# EasyEDA schematic SCH_miniEsp_2025-01-17.json
TITLE: miniEsp; REV: 1.0; Date: 2024-12-11; Sheet: 1/1; Drawn By: Valerian Tora; Company: unemployed
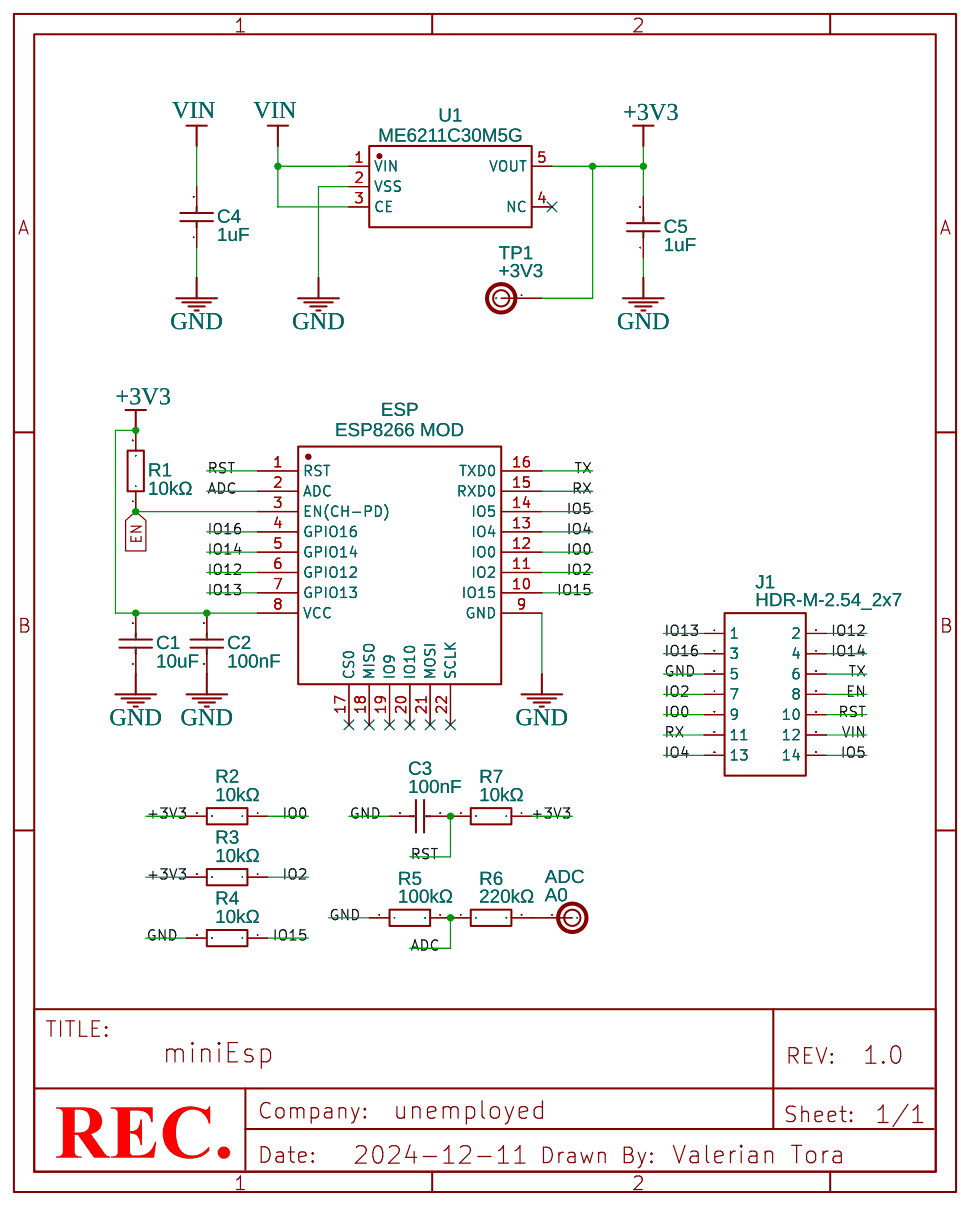
[diagram p0: schematic sheet]

## Parts
ADC  A0  [TESTPOINT_0.8MM]
C1  10uF  [C0805]
C2  100nF  [C0805]
C3  100nF  [C0805]
C4  1uF  [C0805]
C5  1uF  [C0805]
ESP  ESP8266 MOD  [ESP-12E(ESP8266MOD)]
J1  HDR-M-2.54_2x7  [HDR-M-2.54_2X7]
R1  10kΩ  [R0603]
R2  10kΩ  [R0603]
R3  10kΩ  [R0603]
R4  10kΩ  [R0603]
R5  100kΩ  [R0603]
R6  220kΩ  [R0603]
R7  10kΩ  [R0603]
TP1  +3V3  [TESTPOINT_0.8MM]
U1  ME6211C30M5G  [SOT-23-5_L3.0-W1.7-P0.95-LS2.8-BR]

## Library data of the parts
ADC TP1 = Test Point: Contributor: Valerian Tora
C1 = CL21A106KPFNNNE: Supplier: LCSC; Manufacturer: SAMSUNG(三星); Supplier Part: C17024; JLCPCB Part Class: Extended Part; link: https://lcsc.com/eda_search?q=C17024&%26type=1&ref=editor
C2 C3 = CL21B104KBCNNNC: Supplier: LCSC; Manufacturer: SAMSUNG(三星); Supplier Part: C1711; JLCPCB Part Class: Extended Part
C4 C5 = CL21B105KBFNNNE: Supplier: LCSC; Manufacturer: SAMSUNG(三星); Supplier Part: C28323; JLCPCB Part Class: Basic Part
ESP = ESP8266 12F: Manufacturer: Ai-Thinker(安信可); Manufacturer Part: ESP-12F(ESP8266MOD); JLCPCB Part Class: Extended Part
J1 = HDR-M-2.54_2x7: Supplier Part: C71397; Supplier: LCSC; Contributor: LCEDA_Lib
R1-R4 R7 = AC0603FR-0710KL: Supplier: LCSC; Manufacturer: YAGEO(国巨); Supplier Part: C116677; JLCPCB Part Class: Extended Part
R5 = RC0603FR-07100KL: Contributor: LCSC; Supplier: LCSC; Supplier Part: C14675; Manufacturer: YAGEO(国巨); JLCPCB Part Class: Extended Part
R6 = RC0603FR-07220KL: Supplier: LCSC; Manufacturer: YAGEO(国巨); Supplier Part: C123420; JLCPCB Part Class: Extended Part
U1 = ME6211C30M5G: Contributor: LCSC; Supplier: LCSC; Supplier Part: C94042; Manufacturer: MICRONE(南京微盟); JLCPCB Part Class: Extended Part

## Nets
+3V3: C1.2 C2.2 C5.2 ESP.8(VCC) R1.2 R2.2 R3.2 R7.1 TP1.1 U1.5(VOUT)
GND: C1.1 C2.1 C3.2 C4.1 C5.1 ESP.9(GND) J1.5 R4.2 R5.1 U1.2(VSS)
VIN: C4.2 J1.12 U1.1(VIN) U1.3(CE)
ADC: ESP.2(ADC) R5.2 R6.1
EN: ESP.3(EN(CH-PD)) J1.8 R1.1
IO0: ESP.12(IO0) J1.9 R2.1
IO2: ESP.11(IO2) J1.7 R3.1
IO4: ESP.13(IO4) J1.13
IO5: ESP.14(IO5) J1.14
IO12: ESP.6(GPIO12) J1.2
IO13: ESP.7(GPIO13) J1.1
IO14: ESP.5(GPIO14) J1.4
IO15: ESP.10(IO15) R4.1
IO16: ESP.4(GPIO16) J1.3
RST: C3.1 ESP.1(RST) J1.10 R7.2
RX: ESP.15(RXD0) J1.11
TX: ESP.16(TXD0) J1.6
Net-(ADC-1): ADC.1 R6.2

Not connected (* = marked no-connect by the designer): ESP 17(CS0)* 18(MISO)* 19(IO9)* 20(IO10)* 21(MOSI)* 22(SCLK)*; U1 4(NC)*
